# EasyEDA schematic LedCube4x4x6OptoFin.json
TITLE: Sheet_1; REV: 1.0; Date: 2024-02-14; Sheet: 1/1; Company: mymcpr0j
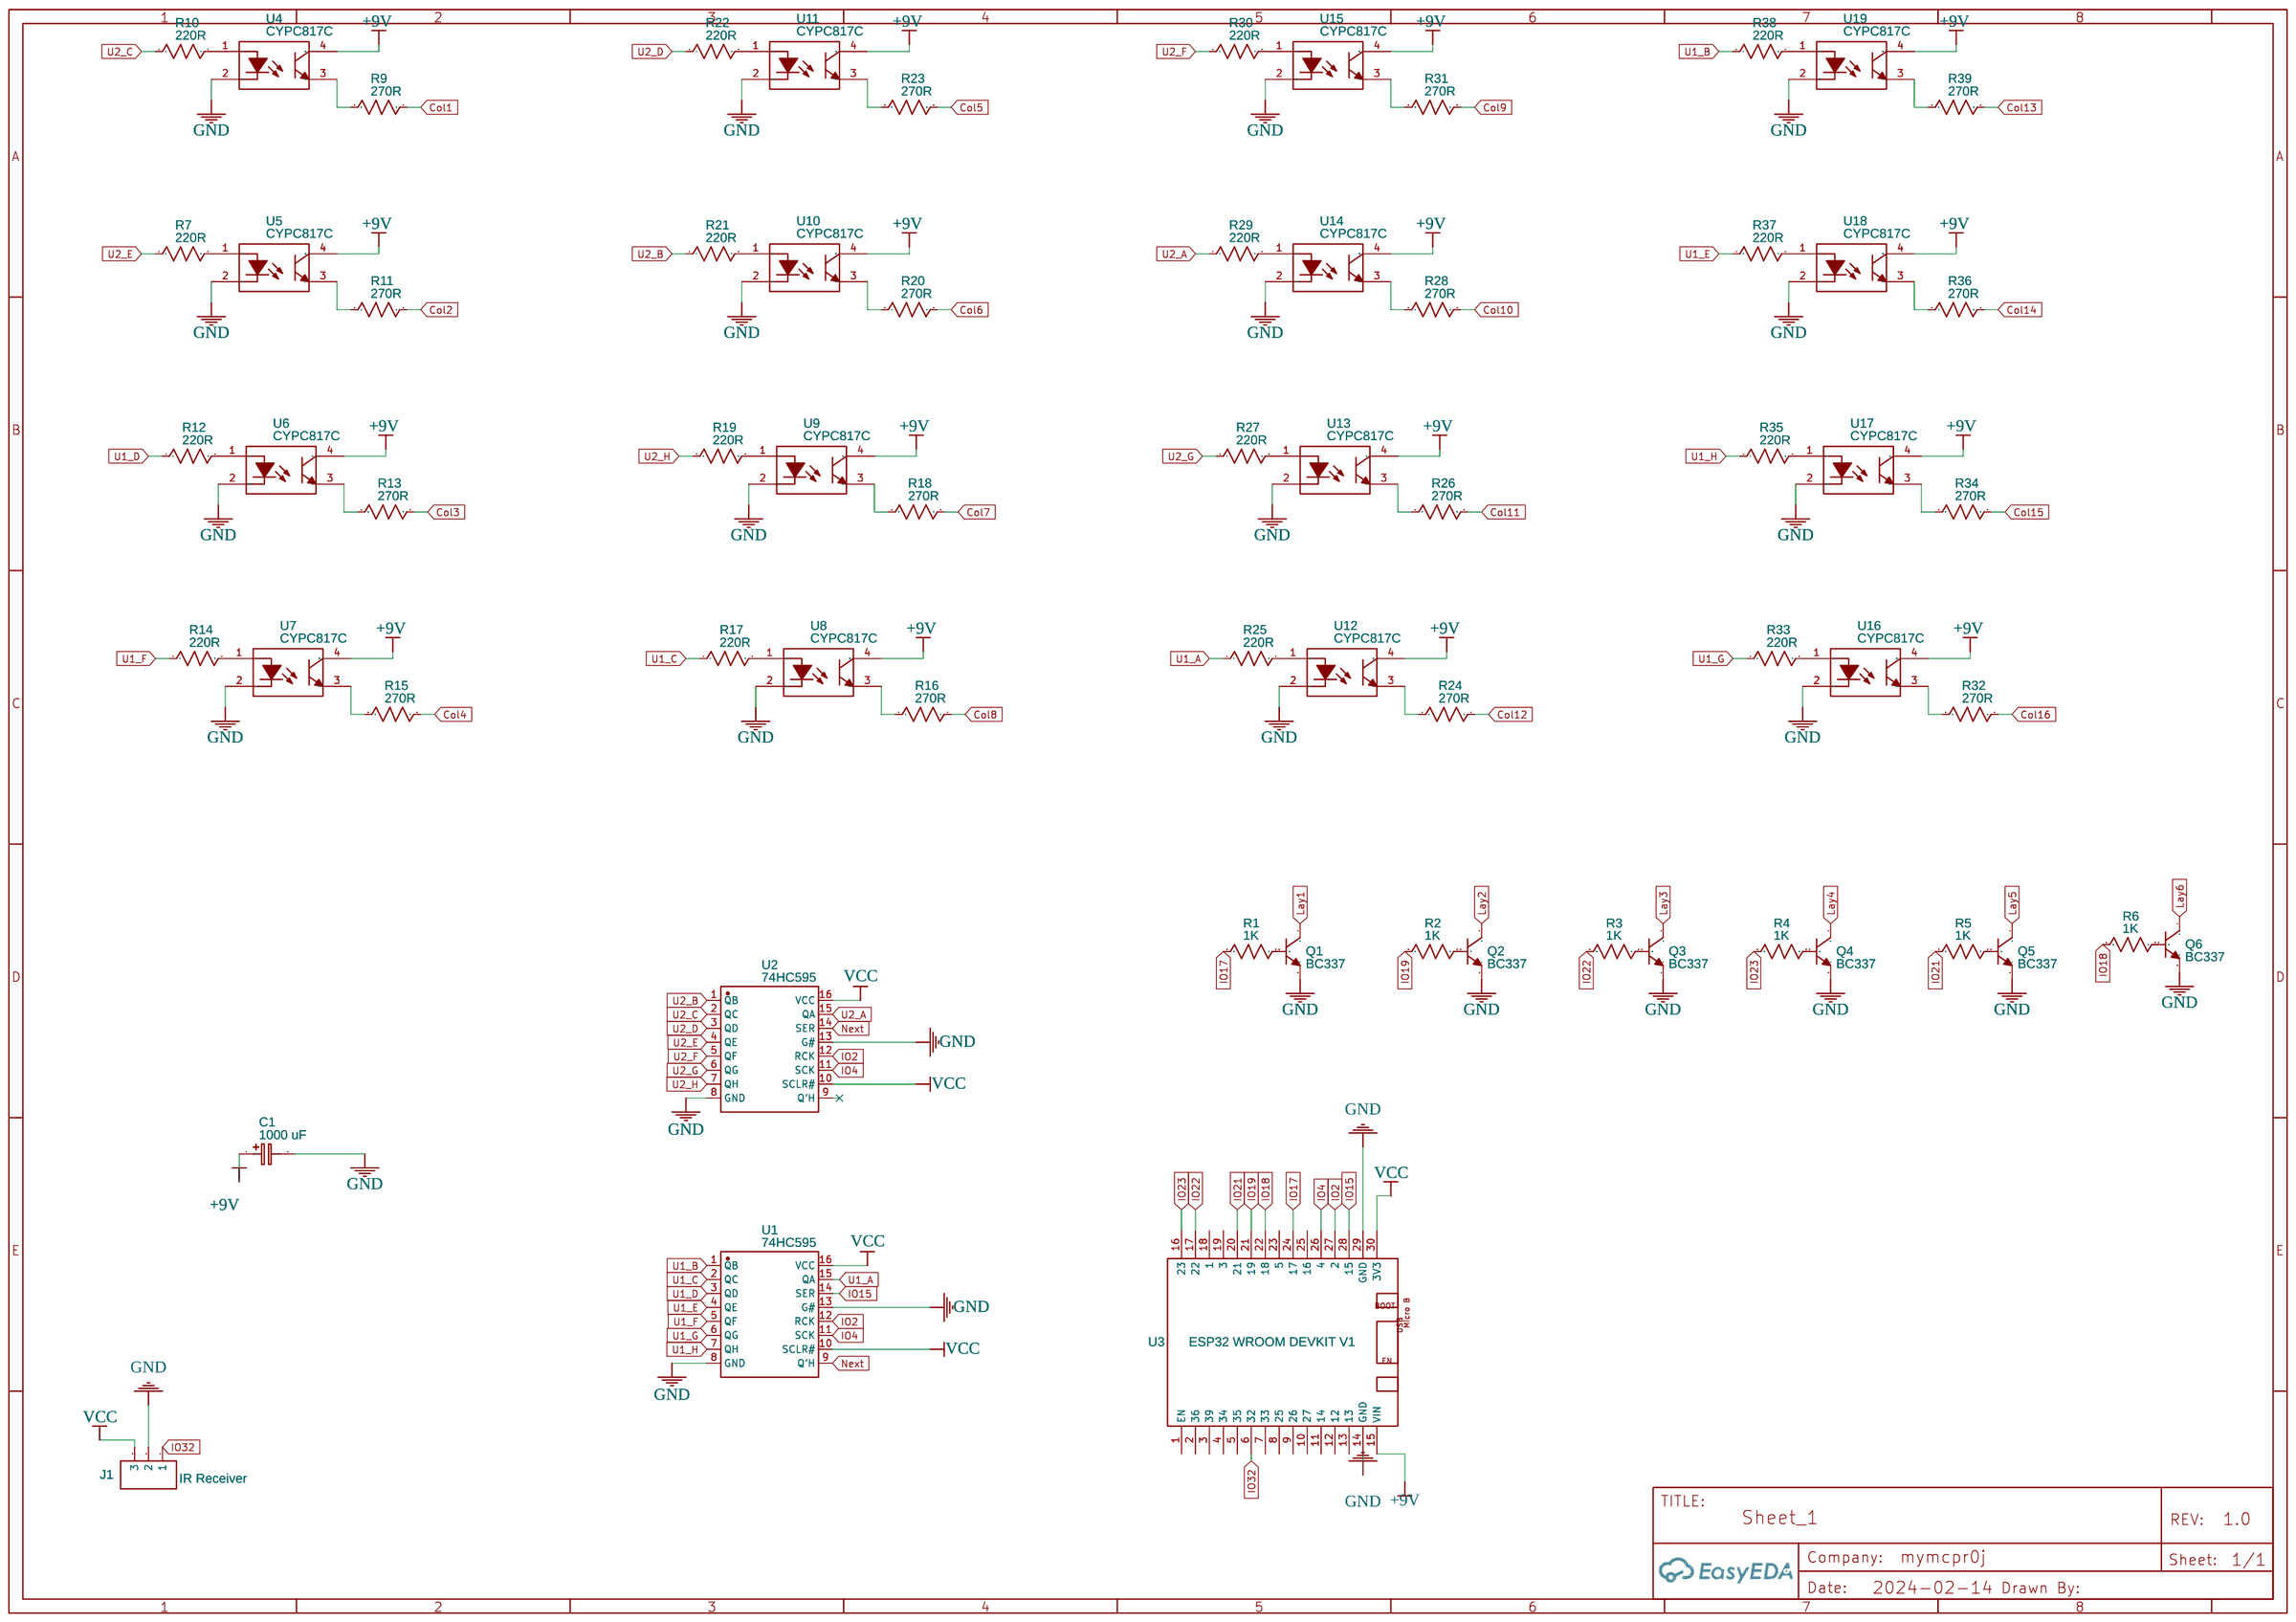
[diagram p0: schematic sheet]

## Parts
C1  1000 uF  [CASE-A_3216]
J1  IR Receiver  [HDR-M-2.54_1X3]
Q1  BC337  [2N2222A]
Q2  BC337  [2N2222A]
Q3  BC337  [2N2222A]
Q4  BC337  [2N2222A]
Q5  BC337  [2N2222A]
Q6  BC337  [2N2222A]
R1  1K  [R0603]
R2  1K  [R0603]
R3  1K  [R0603]
R4  1K  [R0603]
R5  1K  [R0603]
R6  1K  [R0603]
R7  220R  [R0603]
R9  270R  [R0603]
R10  220R  [R0603]
R11  270R  [R0603]
R12  220R  [R0603]
R13  270R  [R0603]
R14  220R  [R0603]
R15  270R  [R0603]
R16  270R  [R0603]
R17  220R  [R0603]
R18  270R  [R0603]
R19  220R  [R0603]
R20  270R  [R0603]
R21  220R  [R0603]
R22  220R  [R0603]
R23  270R  [R0603]
R24  270R  [R0603]
R25  220R  [R0603]
R26  270R  [R0603]
R27  220R  [R0603]
R28  270R  [R0603]
R29  220R  [R0603]
R30  220R  [R0603]
R31  270R  [R0603]
R32  270R  [R0603]
R33  220R  [R0603]
R34  270R  [R0603]
R35  220R  [R0603]
R36  270R  [R0603]
R37  220R  [R0603]
R38  220R  [R0603]
R39  270R  [R0603]
U1  74HC595  [SOP-16_L9.9-W3.9-P1.27-LS6.0-BL]
U2  74HC595  [SOP-16_L9.9-W3.9-P1.27-LS6.0-BL]
U3  ESP32 WROOM DEVKIT V1  [DOIT-ESP32-DEVKIT-V1]
U4  CYPC817C  [DIP-4_L6.4-W4.6-P2.54-LS7.6-BL]
U5  CYPC817C  [DIP-4_L6.4-W4.6-P2.54-LS7.6-BL]
U6  CYPC817C  [DIP-4_L6.4-W4.6-P2.54-LS7.6-BL]
U7  CYPC817C  [DIP-4_L6.4-W4.6-P2.54-LS7.6-BL]
U8  CYPC817C  [DIP-4_L6.4-W4.6-P2.54-LS7.6-BL]
U9  CYPC817C  [DIP-4_L6.4-W4.6-P2.54-LS7.6-BL]
U10  CYPC817C  [DIP-4_L6.4-W4.6-P2.54-LS7.6-BL]
U11  CYPC817C  [DIP-4_L6.4-W4.6-P2.54-LS7.6-BL]
U12  CYPC817C  [DIP-4_L6.4-W4.6-P2.54-LS7.6-BL]
U13  CYPC817C  [DIP-4_L6.4-W4.6-P2.54-LS7.6-BL]
U14  CYPC817C  [DIP-4_L6.4-W4.6-P2.54-LS7.6-BL]
U15  CYPC817C  [DIP-4_L6.4-W4.6-P2.54-LS7.6-BL]
U16  CYPC817C  [DIP-4_L6.4-W4.6-P2.54-LS7.6-BL]
U17  CYPC817C  [DIP-4_L6.4-W4.6-P2.54-LS7.6-BL]
U18  CYPC817C  [DIP-4_L6.4-W4.6-P2.54-LS7.6-BL]
U19  CYPC817C  [DIP-4_L6.4-W4.6-P2.54-LS7.6-BL]

## Library data of the parts
C1 = C_Tan_SMD_A_EU: Contributor: LCEDA_Lib
J1 = HDR-M-2.54_1x3: Supplier Part: C180248; Supplier: LCSC; Contributor: LCEDA_Lib
Q1-Q6 = 2N2222A: Supplier Part: C358533; Manufacturer: Foshan Blue Rocket Elec; Contributor: musthafafarhan; JLCPCB Part Class: Extended Part
R1-R7 R9-R39 = R_0603_US: Contributor: LCEDA_Lib
U1 U2 = 74HC595: Supplier: LCSC; Supplier Part: C18164493; Manufacturer: GR(国睿); Contributor: lcsc
U3 = DOIT ESP32 DEVKIT ESP-WROOM-32 CP2102 WIFI Bluetooth ESP8266 w/ label: Contributor: Luis Ángel Guzmán; Supplier: Ali Express; link: https://pt.aliexpress.com/item/32842731763.html
U4-U19 = CYPC817C: Contributor: LCSC; Supplier: LCSC; Supplier Part: C385059; Manufacturer: OCIC(卓睿科); JLCPCB Part Class: Extended Part

## Nets
+9V: C1.1 U3.15(VIN) U4.4(COL) U5.4(COL) U6.4(COL) U7.4(COL) U8.4(COL) U9.4(COL) U10.4(COL) U11.4(COL) U12.4(COL) U13.4(COL) U14.4(COL) U15.4(COL) U16.4(COL) U17.4(COL) U18.4(COL) U19.4(COL)
GND: C1.2 J1.2 Q1.3(E) Q2.3(E) Q3.3(E) Q4.3(E) Q5.3(E) Q6.3(E) U1.8(GND) U1.13(G#) U2.8(GND) U2.13(G#) U3.14(GND) U3.29(GND) U4.2(CAT) U5.2(CAT) U6.2(CAT) U7.2(CAT) U8.2(CAT) U9.2(CAT) U10.2(CAT) U11.2(CAT) U12.2(CAT) U13.2(CAT) U14.2(CAT) U15.2(CAT) U16.2(CAT) U17.2(CAT) U18.2(CAT) U19.2(CAT)
VCC: J1.3 U1.10(SCLR#) U1.16(VCC) U2.10(SCLR#) U2.16(VCC) U3.30(3V3)
Col1: R9.2
Col2: R11.2
Col3: R13.2
Col4: R15.2
Col5: R23.2
Col6: R20.2
Col7: R18.2
Col8: R16.2
Col9: R31.2
Col10: R28.2
Col11: R26.2
Col12: R24.2
Col13: R39.2
Col14: R36.2
Col15: R34.2
Col16: R32.2
IO2: U1.12(RCK) U2.12(RCK) U3.27(2)
IO4: U1.11(SCK) U2.11(SCK) U3.26(4)
IO15: U1.14(SER) U3.28(15)
IO17: R1.2 U3.24(17)
IO18: R6.2 U3.22(18)
IO19: R2.2 U3.21(19)
IO21: R5.2 U3.20(21)
IO22: R3.2 U3.17(22)
IO23: R4.2 U3.16(23)
IO32: J1.1 U3.6(32)
Lay1: Q1.1(C)
Lay2: Q2.1(C)
Lay3: Q3.1(C)
Lay4: Q4.1(C)
Lay5: Q5.1(C)
Lay6: Q6.1(C)
Next: U1.9(Q′H) U2.14(SER)
U1_A: R25.1 U1.15(QA)
U1_B: R38.1 U1.1(QB)
U1_C: R17.1 U1.2(QC)
U1_D: R12.1 U1.3(QD)
U1_E: R37.1 U1.4(QE)
U1_F: R14.1 U1.5(QF)
U1_G: R33.1 U1.6(QG)
U1_H: R35.1 U1.7(QH)
U2_A: R29.1 U2.15(QA)
U2_B: R21.1 U2.1(QB)
U2_C: R10.1 U2.2(QC)
U2_D: R22.1 U2.3(QD)
U2_E: R7.1 U2.4(QE)
U2_F: R30.1 U2.5(QF)
U2_G: R27.1 U2.6(QG)
U2_H: R19.1 U2.7(QH)
Net-(Q1-2): Q1.2(B) R1.1
Net-(Q2-2): Q2.2(B) R2.1
Net-(Q3-2): Q3.2(B) R3.1
Net-(Q4-2): Q4.2(B) R4.1
Net-(Q5-2): Q5.2(B) R5.1
Net-(Q6-2): Q6.2(B) R6.1
Net-(R7-2): R7.2 U5.1(AN)
Net-(R9-1): R9.1 U4.3(EMI)
Net-(R10-2): R10.2 U4.1(AN)
Net-(R11-1): R11.1 U5.3(EMI)
Net-(R12-2): R12.2 U6.1(AN)
Net-(R13-1): R13.1 U6.3(EMI)
Net-(R14-2): R14.2 U7.1(AN)
Net-(R15-1): R15.1 U7.3(EMI)
Net-(R16-1): R16.1 U8.3(EMI)
Net-(R17-2): R17.2 U8.1(AN)
Net-(R18-1): R18.1 U9.3(EMI)
Net-(R19-2): R19.2 U9.1(AN)
Net-(R20-1): R20.1 U10.3(EMI)
Net-(R21-2): R21.2 U10.1(AN)
Net-(R22-2): R22.2 U11.1(AN)
Net-(R23-1): R23.1 U11.3(EMI)
Net-(R24-1): R24.1 U12.3(EMI)
Net-(R25-2): R25.2 U12.1(AN)
Net-(R26-1): R26.1 U13.3(EMI)
Net-(R27-2): R27.2 U13.1(AN)
Net-(R28-1): R28.1 U14.3(EMI)
Net-(R29-2): R29.2 U14.1(AN)
Net-(R30-2): R30.2 U15.1(AN)
Net-(R31-1): R31.1 U15.3(EMI)
Net-(R32-1): R32.1 U16.3(EMI)
Net-(R33-2): R33.2 U16.1(AN)
Net-(R34-1): R34.1 U17.3(EMI)
Net-(R35-2): R35.2 U17.1(AN)
Net-(R36-1): R36.1 U18.3(EMI)
Net-(R37-2): R37.2 U18.1(AN)
Net-(R38-2): R38.2 U19.1(AN)
Net-(R39-1): R39.1 U19.3(EMI)

Not connected (* = marked no-connect by the designer): U2 9(Q′H); U3 1(EN) 2(36) 3(39) 4(34) 5(35) 7(33) 8(25) 9(26) 10(27) 11(14) 12 13 18(1) 19(3) 23(5) 25(16)
